# EAGLE design deep (EAGLE 7.6.0)
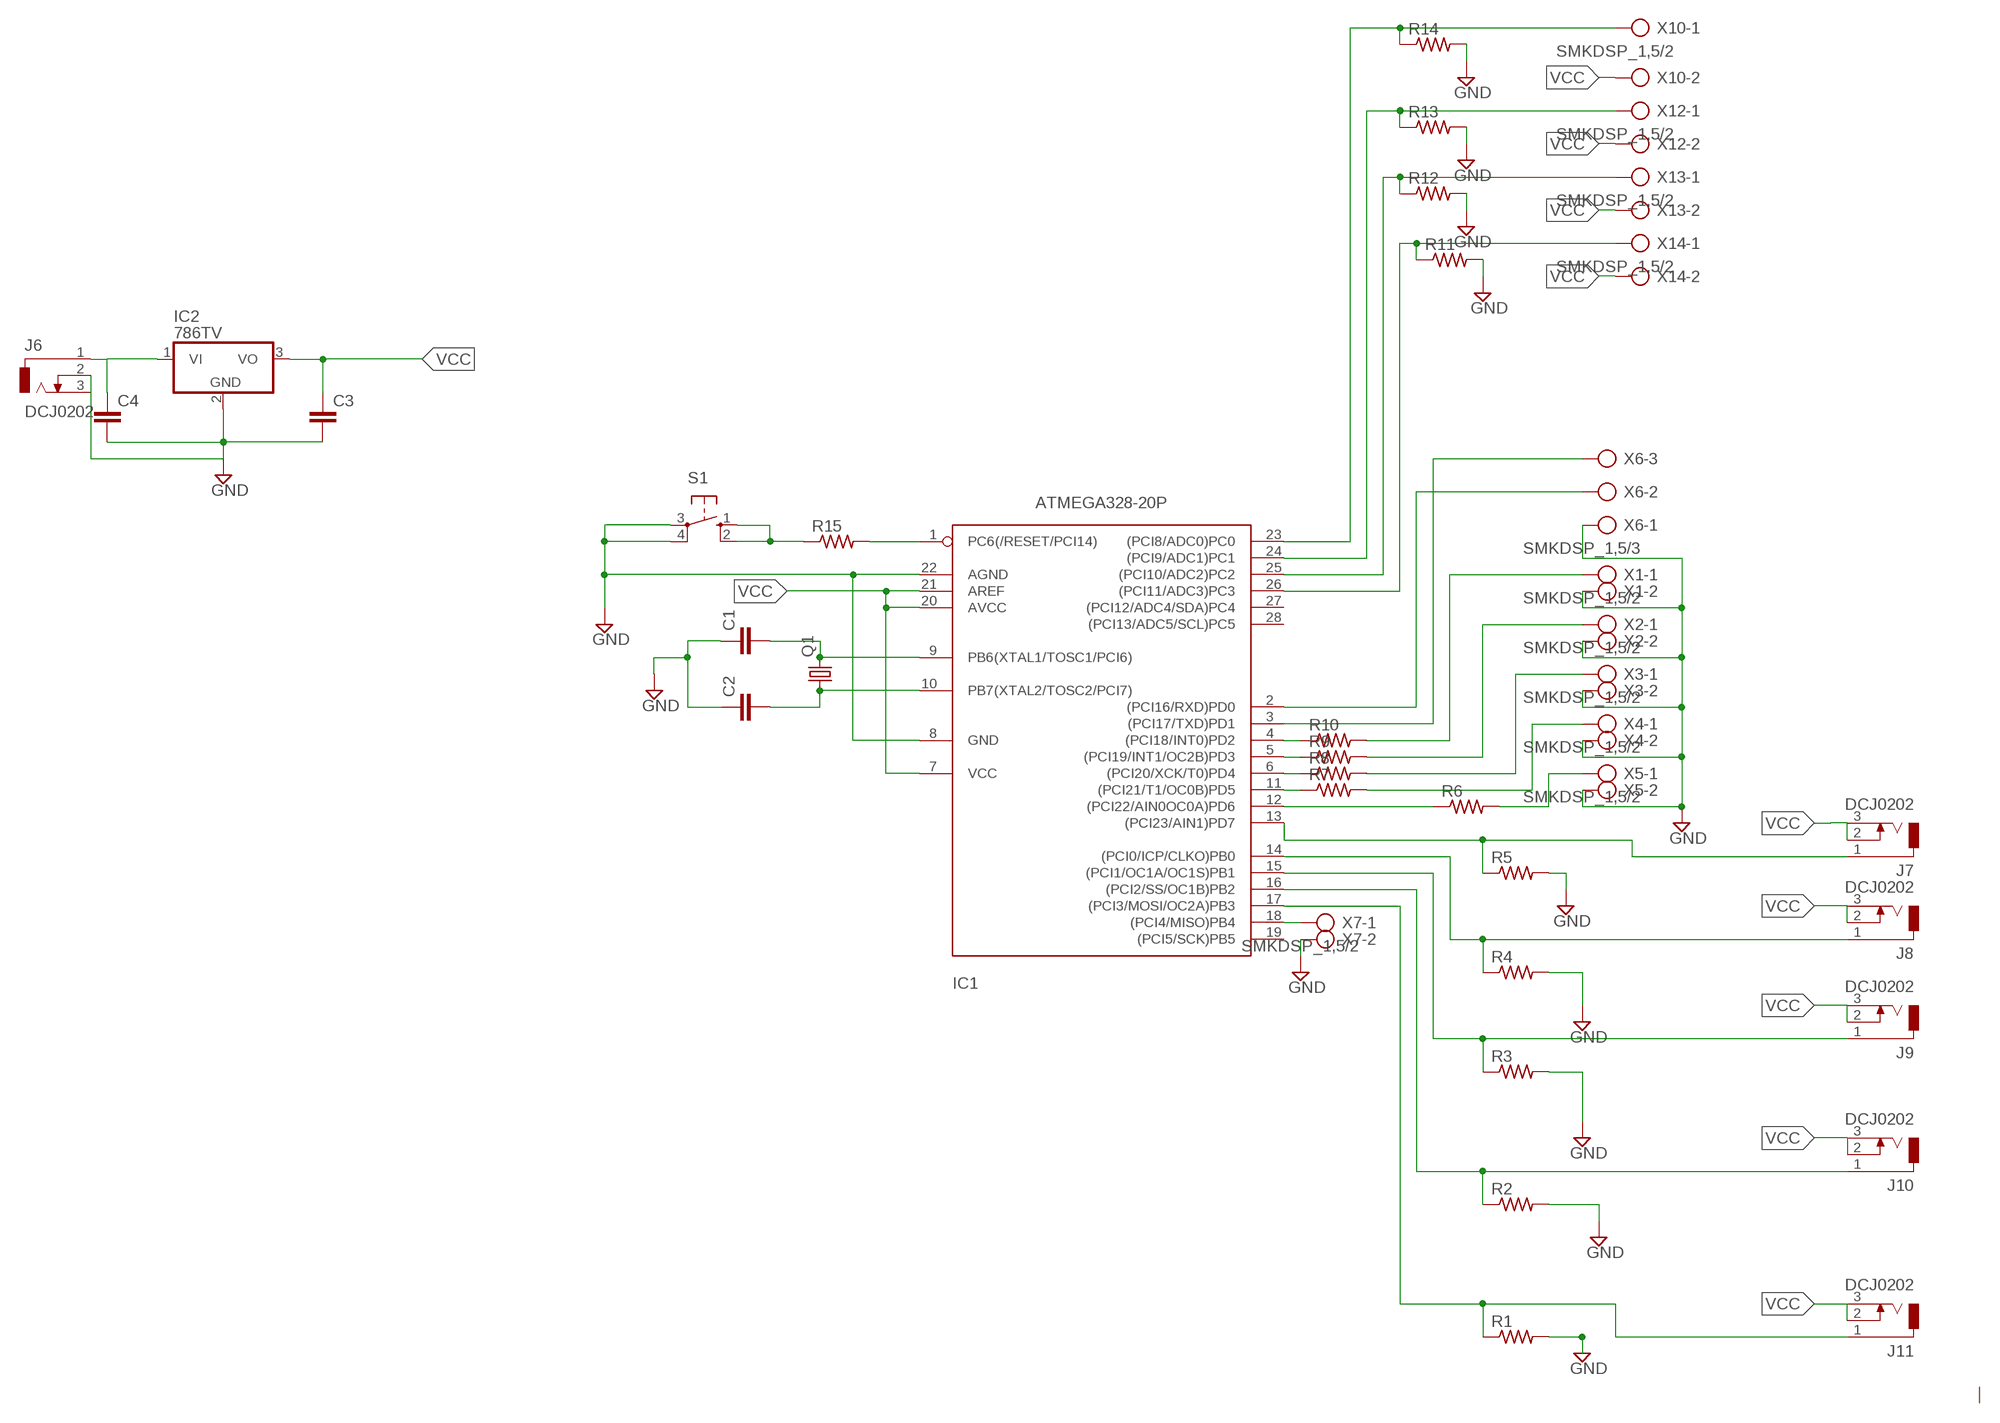
[diagram p0: schematic, sheet 1]

## Parts
C1  C-EU025-030X050  [C025-030X050]
C2  C-EU025-030X050  [C025-030X050]
C3  C-EU025-025X050  [C025-025X050]
C4  C-EU025-025X050  [C025-025X050]
IC1  ATMEGA328-20P  [DIL28-3]
IC2  786TV  [TO220V]
J6  DCJ0202  [DCJ0202]
J7  DCJ0202  [DCJ0202]
J8  DCJ0202  [DCJ0202]
J9  DCJ0202  [DCJ0202]
J10  DCJ0202  [DCJ0202]
J11  DCJ0202  [DCJ0202]
Q1  CRYSTALHC49U70  [HC49U70]
R1  R-US_0207/10  [0207/10]
R2  R-US_0207/10  [0207/10]
R3  R-US_0207/10  [0207/10]
R4  R-US_0207/10  [0207/10]
R5  R-US_0207/10  [0207/10]
R6  R-US_0207/10  [0207/10]
R7  R-US_0207/10  [0207/10]
R8  R-US_0207/10  [0207/10]
R9  R-US_0207/10  [0207/10]
R10  R-US_0207/10  [0207/10]
R11  R-US_0207/10  [0207/10]
R12  R-US_0207/10  [0207/10]
R13  R-US_0207/10  [0207/10]
R14  R-US_0207/10  [0207/10]
R15  R-US_0207/10  [0207/10]
S1  10-XX  [B3F-10XX]
X1  SMKDSP_1,5/2  [SMKDSP_1,5/2]
X2  SMKDSP_1,5/2  [SMKDSP_1,5/2]
X3  SMKDSP_1,5/2  [SMKDSP_1,5/2]
X4  SMKDSP_1,5/2  [SMKDSP_1,5/2]
X5  SMKDSP_1,5/2  [SMKDSP_1,5/2]
X6  SMKDSP_1,5/3  [SMKDSP_1,5/3]
X7  SMKDSP_1,5/2  [SMKDSP_1,5/2]
X10  SMKDSP_1,5/2  [SMKDSP_1,5/2]
X12  SMKDSP_1,5/2  [SMKDSP_1,5/2]
X13  SMKDSP_1,5/2  [SMKDSP_1,5/2]
X14  SMKDSP_1,5/2  [SMKDSP_1,5/2]

## Nets
GND: C1.1 C2.1 C3.2 C4.2 IC1.8(GND) IC1.22(AGND) IC2.2(GND) J6.2 J6.3 R1.2 R2.2 R3.2 R4.2 R5.2 R11.2 R12.2 R13.2 R14.2 S1.3(P) S1.4(P1) X1.2 X2.2 X3.2 X4.2 X5.2 X6.1 X7.2
N$1: C1.2 IC1.9(PB6(XTAL1/TOSC1/PCI6)) Q1.2
N$2: C2.2 IC1.10(PB7(XTAL2/TOSC2/PCI7)) Q1.1
N$3: IC1.1(PC6(/RESET/PCI14)) R15.2
N$4: R15.1 S1.1(S) S1.2(S1)
N$5: IC1.12((PCI22/AIN0OC0A)PD6) R6.1
N$6: IC1.11((PCI21/T1/OC0B)PD5) R7.1
N$7: IC1.6((PCI20/XCK/T0)PD4) R8.1
N$8: IC1.5((PCI19/INT1/OC2B)PD3) R9.1
N$9: IC1.4((PCI18/INT0)PD2) R10.1
N$10: IC1.2((PCI16/RXD)PD0) X6.2
N$11: IC1.14((PCI0/ICP/CLKO)PB0) J8.1 R4.1
N$12: IC1.15((PCI1/OC1A/OC1S)PB1) J9.1 R3.1
N$13: IC1.16((PCI2/SS/OC1B)PB2) J10.1 R2.1
N$14: IC1.17((PCI3/MOSI/OC2A)PB3) J11.1 R1.1
N$15: R10.2 X1.1
N$16: R9.2 X2.1
N$17: R8.2 X3.1
N$18: R7.2 X4.1
N$19: R6.2 X5.1
N$20: IC1.3((PCI17/TXD)PD1) X6.3
N$21: IC1.24((PCI9/ADC1)PC1) R13.1 X12.1
N$22: IC1.13((PCI23/AIN1)PD7) J7.1 R5.1
N$23: C4.1 IC2.1(VI) J6.1
N$24: IC1.18((PCI4/MISO)PB4) X7.1
N$25: IC1.23((PCI8/ADC0)PC0) R14.1 X10.1
N$27: J7.2 J7.3
N$28: IC1.25((PCI10/ADC2)PC2) R12.1 X13.1
N$29: IC1.26((PCI11/ADC3)PC3) R11.1 X14.1
VCC: C3.1 IC1.7(VCC) IC1.20(AVCC) IC1.21(AREF) IC2.3(VO) J8.2 J8.3 J9.2 J9.3 J10.2 J10.3 J11.2 J11.3 X10.2 X12.2 X13.2 X14.2
Unconnected: IC1.19((PCI5/SCK)PB5) IC1.27((PCI12/ADC4/SDA)PC4) IC1.28((PCI13/ADC5/SCL)PC5)

## Library data of the parts
C1-C4 = rcl:C-EU: CAPACITOR, European symbol
IC1 = atmega328:ATMEGA328*P: MICROCONTROLLER 32 kBytes FLASH 2 kBytes SRAM 1 kBytes EEPROM USART 8-channel 10 bit ADC
IC2 = linear:78*: Positive VOLTAGE REGULATOR Source: http://cache.national.com/ds/LM/LM78L05.pdf http://www.fairchildsemi.com/ds/LM/LM7805.pdf
J6-J11 = con-jack:DCJ0202: DC POWER JACK Source: DCJ0202.pdf; OC_FARNELL: unknown; OC_NEWARK: unknown
Q1 = crystal:CRYSTAL: CRYSTAL; OC_FARNELL: unknown; OC_NEWARK: unknown
R1-R15 = rcl:R-US_: RESISTOR, American symbol
S1 = switch-omron:10-XX: OMRON SWITCH; MPN: B3F-1000; OC_FARNELL: 176432; OC_NEWARK: 36M3542
X1-X5 X7 X10 X12-X14 = con-phoenix-smkdsp:SMKDSP_1,5/2: Printklemme, Nennstrom: 17,5 A, Bemessungsspannung: 250 V, Raster: 5,0 mm Source: http://eshop.phoenixcontact.de .. 1733415.pdf; MF: FARNELL; MPN: 1733570; OC_FARNELL: 3041244; OC_NEWARK: 69C8588
X6 = con-phoenix-smkdsp:SMKDSP_1,5/3: Printklemme, Nennstrom: 17,5 A, Bemessungsspannung: 250 V, Raster: 5,0 mm Source: http://eshop.phoenixcontact.de .. 1733415.pdf; MF: FARNELL; MPN: 1733583; OC_FARNELL: 3041256; OC_NEWARK: 71C4130

## Board
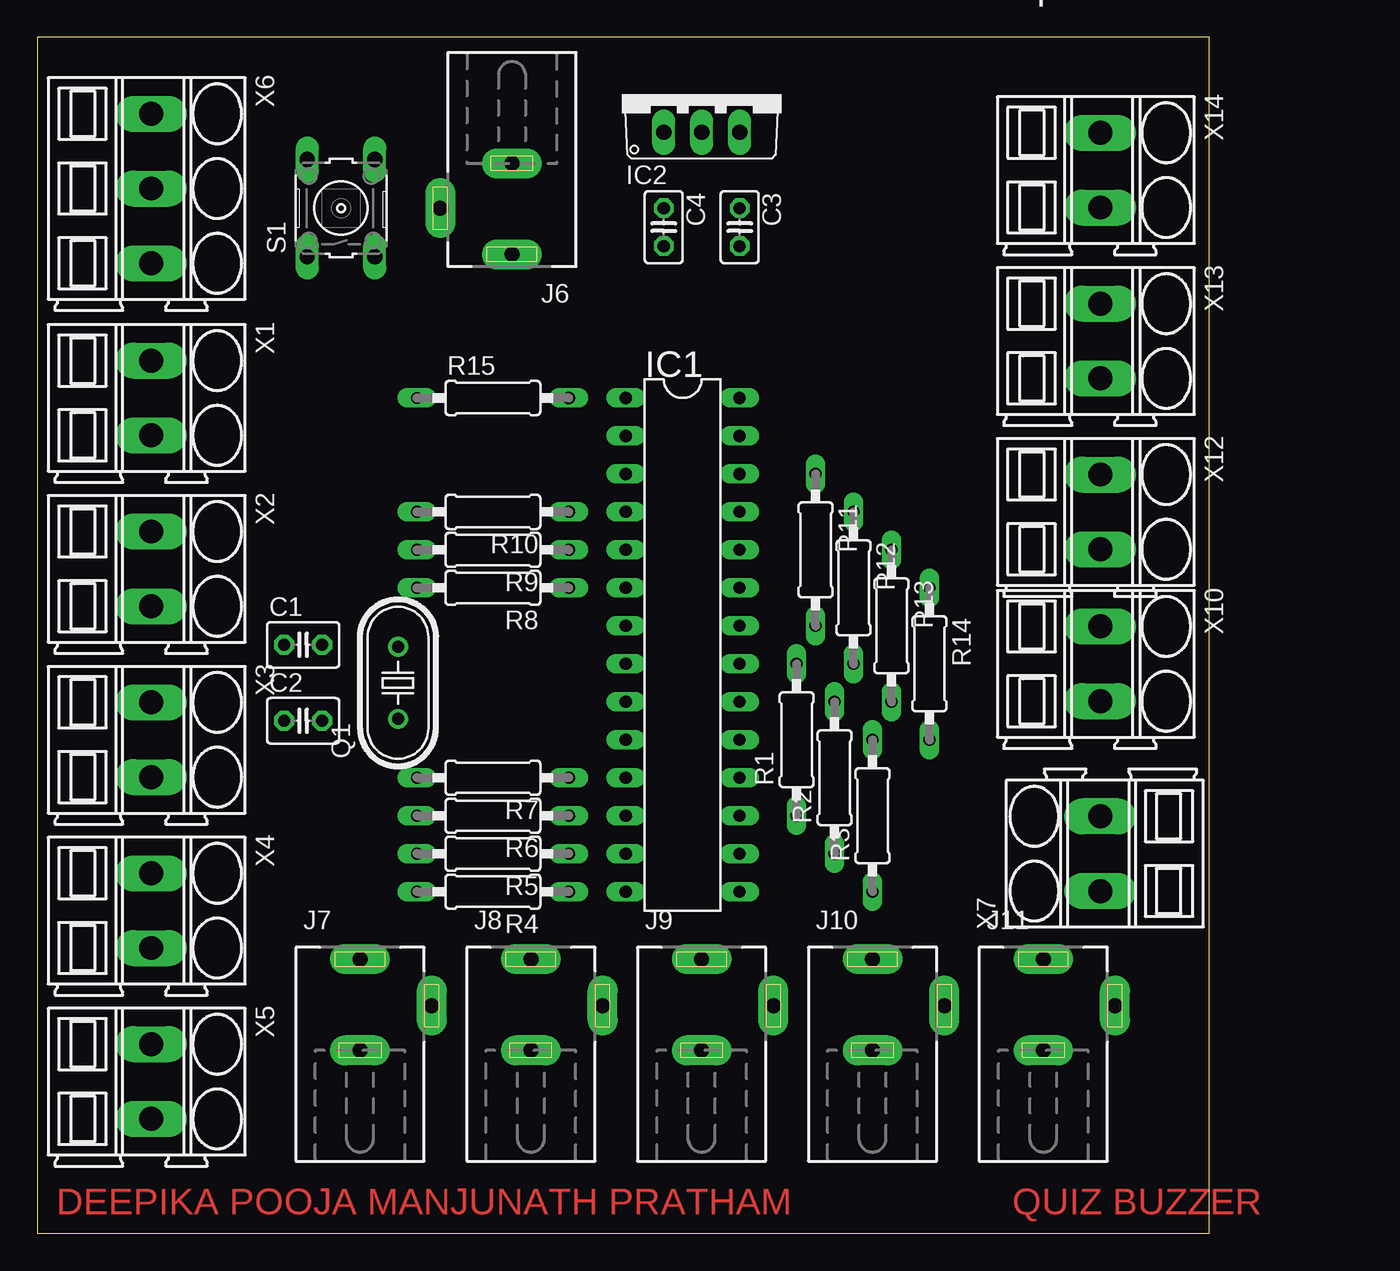
[diagram p1: board, top side]
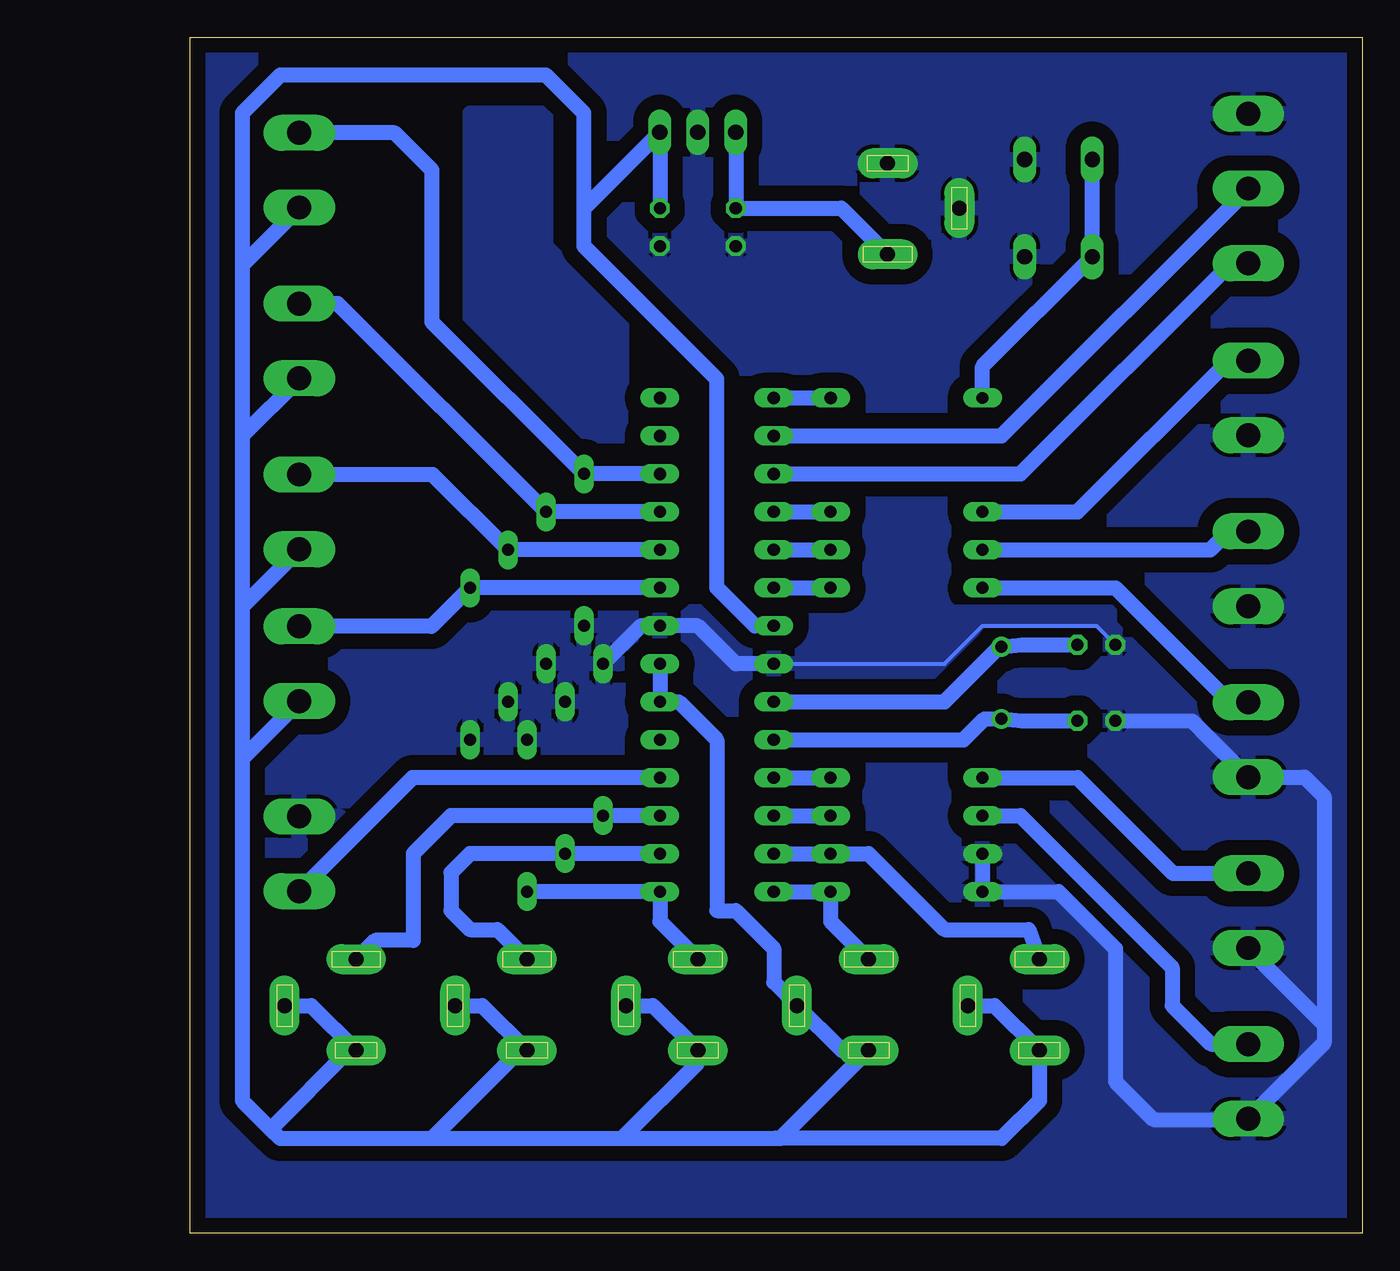
[diagram p2: board, bottom side, seen from below]

Size 78.41 x 80 mm. Coordinates in mm from the lower left corner, seen from the top.
Outline: 0,0 78.41,0 78.41,80 0,80 0,0
Copper layers (1*16): Top 0.035mm / dielectric 1.5mm / Bottom 0.035mm
Design rules "default": minimum track width 10mil, minimum drill 24mil, track to track 8mil, track to pad 8mil, pad to pad 8mil, via to via 8mil, smd to smd 8mil, copper to edge 40mil, drill to drill 8mil, minimum pad ring 10mil, minimum via ring 8mil, stop-mask expansion 4mil, vias tented up to drill 0mil, thermal gap 10mil

### Footprints (pad centres in the part's own frame; a part is rotated, then mirrored left to right if it is on the bottom)
C025-030X050 = drill 0.813 octagon: 1 -1.27,0; 2 1.27,0
C025-025X050 = drill 0.813 octagon: 1 -1.27,0; 2 1.27,0
DIL28-3 = drill 0.813 long: 1 -16.51,-3.81; 2 -13.97,-3.81; 3 -11.43,-3.81; 4 -8.89,-3.81; 5 -6.35,-3.81; 6 -3.81,-3.81; 7 -1.27,-3.81; 8 1.27,-3.81; 9 3.81,-3.81; 10 6.35,-3.81; 11 8.89,-3.81; 12 11.43,-3.81; 13 13.97,-3.81; 14 16.51,-3.81; 15 16.51,3.81; 16 13.97,3.81; 17 11.43,3.81; 18 8.89,3.81; 19 6.35,3.81; 20 3.81,3.81; 21 1.27,3.81; 22 -1.27,3.81; 23 -3.81,3.81; 24 -6.35,3.81; 25 -8.89,3.81; 26 -11.43,3.81; 27 -13.97,3.81; 28 -16.51,3.81
TO220V = drill 1.016 long: 1 -2.54,-2.54; 2 0,-2.54; 3 2.54,-2.54
DCJ0202 = drill 1 pad 2 long: 1 0,3.1; 2 4.8,0; 3 0,-3
HC49U70 = drill 0.813: 1 -2.413,0; 2 2.413,0
0207/10 = drill 0.8 long: 1 -5.08,0 | drill 0.813 long: 2 5.08,0
B3F-10XX = drill 1.016 long: 1 -3.251,2.261; 2 3.251,2.261; 3 -3.251,-2.261; 4 3.251,-2.261
SMKDSP_1,5/2 = drill 1.6 pad 1.8 long: 1 -2.5,0; 2 2.5,0
SMKDSP_1,5/3 = drill 1.6 pad 1.8 long: 1 -2.5,0; 2 2.5,0; 3 7.5,0

### Placement (x,y rotation side)
C1  17.78,39.37 0 top
C2  17.78,34.29 0 top
C3  46.99,67.31 270 top
C4  41.91,67.31 270 top
IC1  43.18,39.37 270 top
IC2  44.45,76.2 0 top
J6  31.75,68.58 180 top
J7  21.59,15.24 0 top
J8  33.02,15.24 0 top
J9  44.45,15.24 0 top
J10  55.88,15.24 0 top
J11  67.31,15.24 0 top
Q1  24.13,36.83 90 top
R1  50.8,33.02 90 top
R2  53.34,30.48 90 top
R3  55.88,27.94 90 top
R4  30.48,22.86 180 top
R5  30.48,25.4 180 top
R6  30.48,27.94 180 top
R7  30.48,30.48 180 top
R8  30.48,43.18 180 top
R9  30.48,45.72 180 top
R10  30.48,48.26 180 top
R11  52.07,45.72 270 top
R12  54.61,43.18 270 top
R13  57.15,40.64 270 top
R14  59.69,38.1 270 top
R15  30.48,55.88 0 top
S1  20.32,68.58 90 top
X1  7.62,55.88 270 top
X2  7.62,44.45 270 top
X3  7.62,33.02 270 top
X4  7.62,21.59 270 top
X5  7.62,10.16 270 top
X6  7.62,72.39 270 top
X7  71.12,25.4 90 top
X10  71.12,38.1 270 top
X12  71.12,48.26 270 top
X13  71.12,59.69 270 top
X14  71.12,71.12 270 top

### Tracks (layer width: path | path; a pad name or v marks a point on that pad's centre or on a via)
GND
  Bottom 0.254: IC1.8 27.94,38.1 25.4,40.64 17.78,40.64 C1.1
  Bottom 1.016: IC1.8 41.91,38.1 44.45,40.64 IC1.22 48.26,40.64 R1.2 | C2.1 11.39,34.29 X3.2 3.85,30.52 2.54,29.21 2.54,13.97 | 2.54,13.97 2.54,12.74 X5.2 7.66,7.62 13.97,7.62 16.51,10.16 16.51,19.05 20.32,22.86 R4.2 R5.2 | X4.2 7.62,19.05 2.54,13.97
  pour Bottom (isolate 0.406): 16.51,41.91 27.94,41.91 27.94,40.64 16.51,40.64
  pour Bottom (isolate 1.016): 0,80.01 78.74,80.01 78.74,0 0,0
N$1
  Bottom 1.016: C1.2 22.73,39.37 Q1.2 24.26,39.24 27.94,35.56 IC1.9
N$2
  Bottom 1.016: IC1.10 26.67,33.02 25.27,34.42 Q1.1 22.73,34.29 C2.2
N$3
  Bottom 1.016: IC1.1 R15.2
N$4
  Bottom 1.016: S1.2 S1.1 25.4,57.99 R15.1
N$5
  Bottom 1.016: IC1.12 R6.1
N$6
  Bottom 1.016: IC1.11 R7.1
N$7
  Bottom 1.016: IC1.6 R8.1
N$8
  Bottom 1.016: IC1.5 R9.1
N$9
  Bottom 1.016: IC1.4 R10.1
N$10
  Bottom 1.016: IC1.2 24.13,53.34 7.62,69.85 X6.2
N$11
  Bottom 1.016: IC1.14 R4.1 35.56,20.88 J8.1
N$12
  Bottom 1.016: R3.1 IC1.15 46.99,20.88 J9.1
N$13
  Bottom 1.016: IC1.16 R2.1 59.69,25.4 60.96,24.13 60.96,21.59 59.69,20.32 57.86,20.32 J10.1
N$14
  Bottom 1.016: IC1.17 R1.1 60.96,27.94 63.5,25.4 63.5,19.61 66.04,19.61 J11.1
N$15
  Bottom 1.016: R10.2 19.05,48.26 8.93,58.38 X1.1
N$16
  Bottom 1.016: R9.2 10.16,45.72 8.93,46.95 X2.1
N$17
  Bottom 1.016: R8.2 16.51,43.18 8.85,35.52 X3.1
N$18
  Bottom 1.016: X4.1 12.66,24.09 19.05,30.48 R7.2
N$19
  Bottom 1.016: R6.2 22.86,27.94 12.7,17.78 12.7,15.24 10.12,12.66 X5.1
N$20
  Bottom 1.016: IC1.3 22.86,50.8 8.77,64.89 X6.3
N$21
  Bottom 1.016: IC1.24 R13.1 62.19,50.76 X12.1
N$22
  Bottom 1.016: IC1.13 R5.1 33.02,25.4 27.94,20.32 22.3,20.32 J7.1
N$23
  Bottom 1.016: IC2.1 C4.1 34.85,68.58 J6.1
N$24
  Bottom 1.016: IC1.18 63.54,30.48 X7.1
N$25
  Bottom 1.016: IC1.23 R14.1 62.27,40.6 X10.1
N$26
  pour Bottom (isolate 1.016): 54.61,74.93 59.69,74.93 59.69,62.23 59.69,60.96 52.07,53.34 49.53,53.34 49.53,60.96 54.61,66.04
N$27
  Bottom 1.016: 39.37,6.35 24.13,6.35 21.59,8.89 J7.3 24.59,15.24 J7.2
N$28
  Bottom 1.016: IC1.25 R12.1 68.54,62.19 X13.1
N$29
  Bottom 1.016: IC1.26 R11.1 62.23,60.96 62.23,71.12 64.73,73.62 X14.1
N$30
  pour Bottom (isolate 1.016): 49.53,40.64 59.69,40.64 60.96,39.37 60.96,33.02 49.53,33.02
VCC
  Bottom 1.016: C3.1 IC2.3 52.07,68.58 | IC1.7 40.64,40.64 43.18,43.18 43.18,57.15 52.07,66.04 52.07,68.58 | 52.07,68.58 52.07,74.93 54.61,77.47 72.39,77.47 74.93,74.93 74.93,64.77 | 74.93,64.77 74.93,53.34 | 74.93,53.34 74.93,41.91 | 74.93,41.91 74.93,31.75 | 74.93,31.75 74.93,8.89 73.02,6.98 | 73.02,6.98 72.39,6.35 62.23,6.35 | 62.23,6.35 49.53,6.35 | 49.53,6.35 38.91,6.35 J8.3 34.82,12.24 J8.2 39.37,16.79 39.37,19.05 41.91,21.59 43.18,21.59 43.18,33.02 45.72,35.56 IC1.20 IC1.21 | 49.53,6.35 44.45,11.43 J9.3 47.45,15.24 J9.2 | 62.23,6.35 56.34,12.24 J10.3 58.88,15.24 J10.2 | 73.02,6.98 67.77,12.24 J11.3 70.31,15.24 J11.2 | X14.2 71.12,68.58 74.93,64.77 | X13.2 71.12,57.15 74.93,53.34 | X12.2 71.12,45.72 74.93,41.91 | X10.2 71.12,35.56 74.93,31.75

### Text on the board
Top: DEEPIKA POOJA MANJUNATH PRATHAM QUIZ BUZZER
tNames: quiz buzzer